# EAGLE design Esp8266_prot16_v3 (EAGLE 8.4.0)
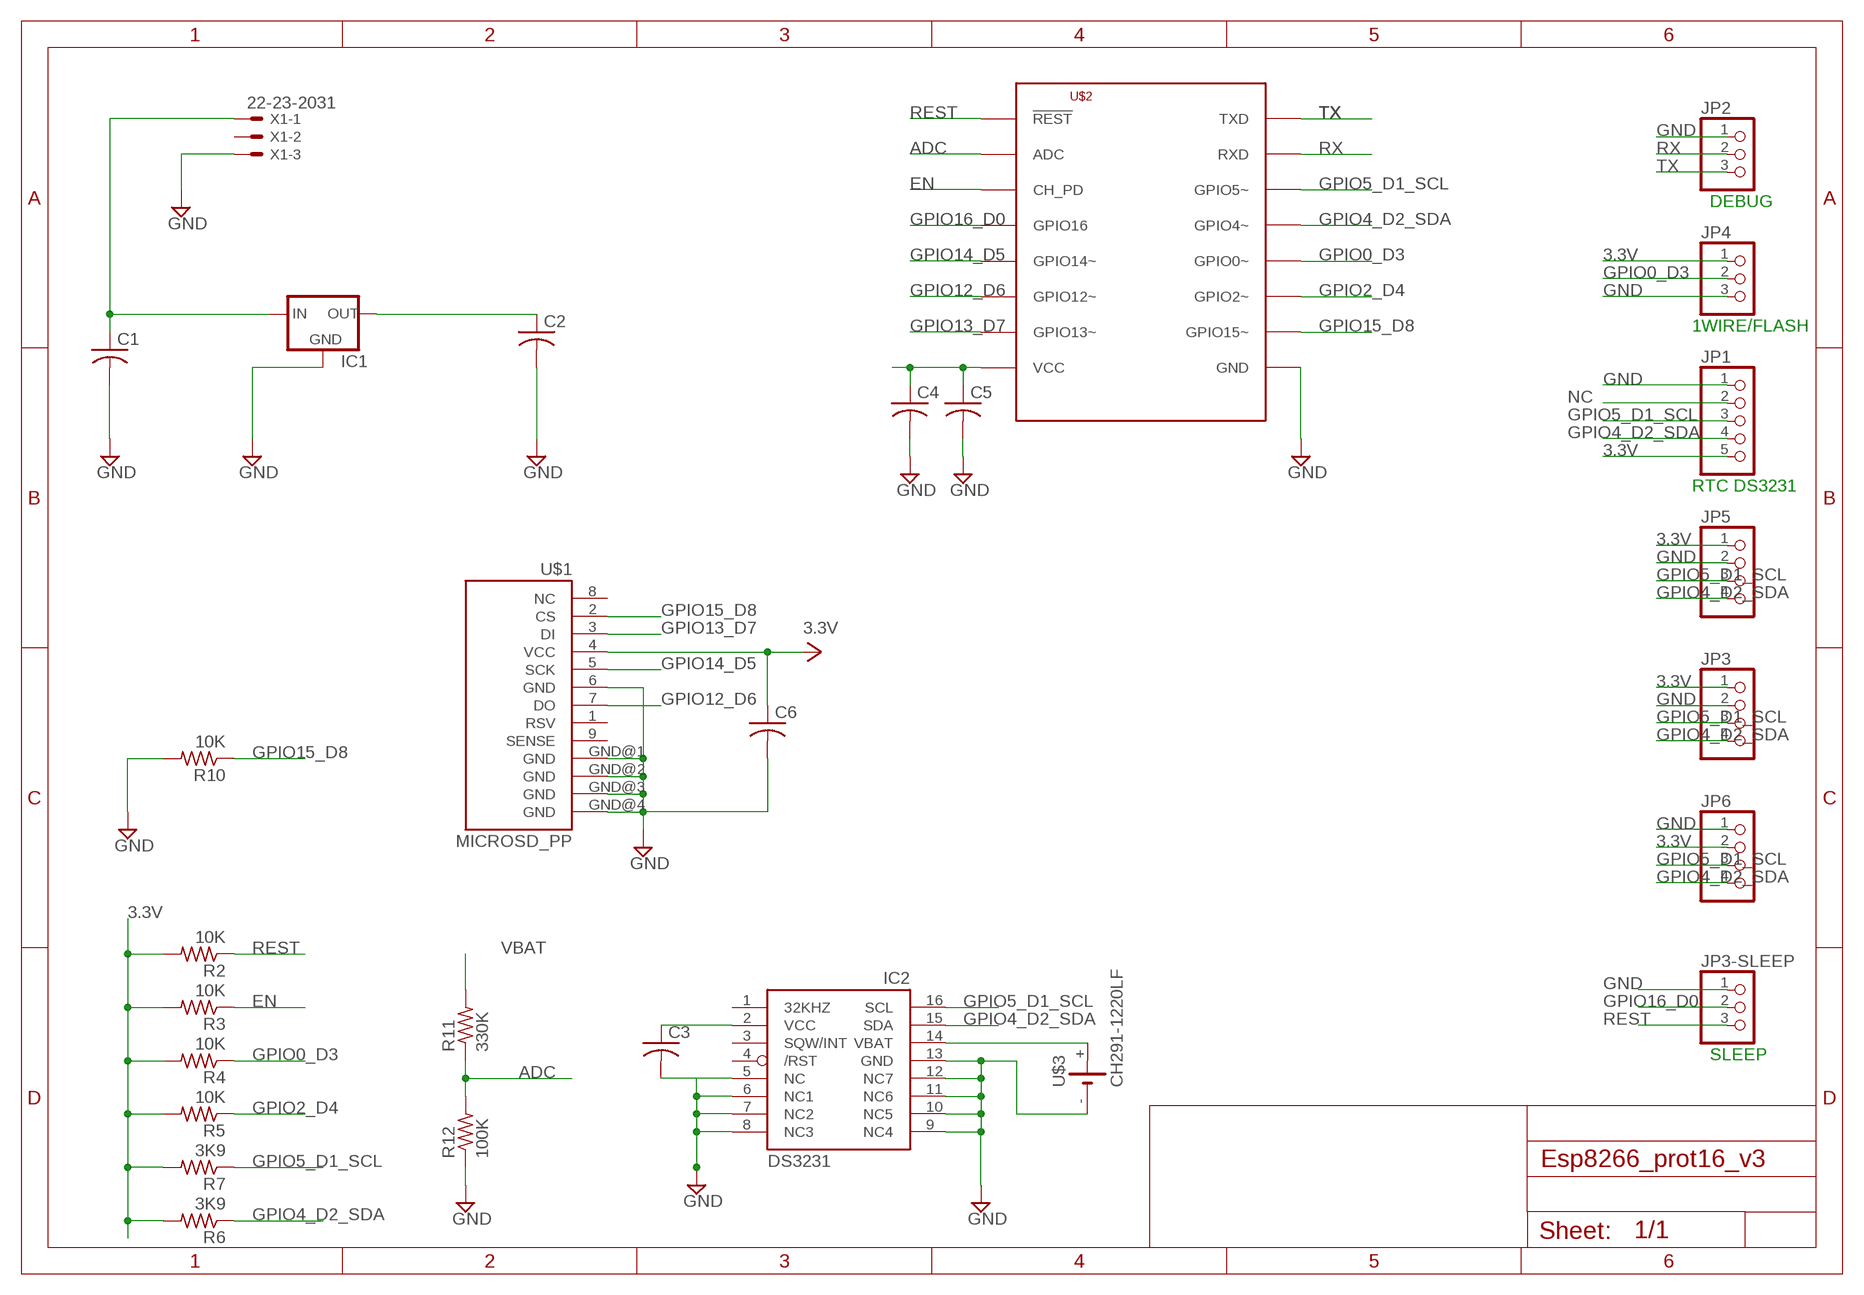
[diagram p0: schematic, sheet 1]

## Parts
C1  C-USC0805K  [C0805K]
C2  C-USC0805K  [C0805K]
C3  C-USC0805K  [C0805K]
C4  C-USC0805K  [C0805K]
C5  C-USC0805K  [C0805K]
C6  C-USC0805K  [C0805K]
IC1  XC63FPP  [SOT89R]
IC2  DS3231/SO  [SO16W]
JP1  PINHD-1X5/90  [1X05/90]
JP2  PINHD-1X3  [1X03]
JP3  PINHD-1X4/90  [1X04/90]
JP3-SLEEP  PINHD-1X3  [1X03]
JP4  PINHD-1X3  [1X03]
JP5  PINHD-1X4  [1X04]
JP6  PINHD-1X4  [1X04]
R2  10K  R-US_R0805  [R0805]
R3  10K  R-US_R0805  [R0805]
R4  10K  R-US_R0805  [R0805]
R5  10K  R-US_R0805  [R0805]
R6  3K9  R-US_R0805  [R0805]
R7  3K9  R-US_R0805  [R0805]
R10  10K  R-US_R0805  [R0805]
R11  330K  R-US_R0805  [R0805]
R12  100K  R-US_R0805  [R0805]
U$1  MICROSD_PP  [MICROSD_PP]
U$2  ESP8266-07  [ESP-07]
U$3  CH291-1220LF  [CH291-1220LF]
X1  22-23-2031  [22-23-2031]

## Nets
3.3V: C2.1 C3.1 C4.1 C5.1 C6.1 IC1.3(OUT) IC2.2(VCC) JP1.5 JP3.1 JP4.1 JP5.1 JP6.2 R2.2 R3.2 R4.2 R5.2 R6.2 R7.2 U$1.4(VCC) U$2.VCC
ADC: R11.1 R12.2 U$2.ADC
BATRTC: IC2.14(VBAT) U$3.+
EN: R3.1 U$2.CH_PD
GND: C1.2 C2.2 C3.2 C4.2 C5.2 C6.2 IC1.1(GND) IC2.5(NC) IC2.6(NC1) IC2.7(NC2) IC2.8(NC3) IC2.9(NC4) IC2.10(NC5) IC2.11(NC6) IC2.12(NC7) IC2.13(GND) JP1.1 JP2.1 JP3-SLEEP.1 JP3.2 JP4.3 JP5.2 JP6.1 R10.2 R12.1 U$1.6(GND) U$1.GND@1(GND) U$1.GND@2(GND) U$1.GND@3(GND) U$1.GND@4(GND) U$2.GND U$3.- X1.3
GPIO0_D3: JP4.2 R4.1 U$2.GPIO0(GPIO0~)
GPIO2_D4: R5.1 U$2.GPIO2(GPIO2~)
GPIO4_D2_SDA: IC2.15(SDA) JP1.4 JP3.4 JP5.4 JP6.4 R6.1 U$2.GPIO5(GPIO4~)
GPIO5_D1_SCL: IC2.16(SCL) JP1.3 JP3.3 JP5.3 JP6.3 R7.1 U$2.GPIO4(GPIO5~)
GPIO12_D6: U$1.7(DO) U$2.GPIO12(GPIO12~)
GPIO13_D7: U$1.3(DI) U$2.GPIO13(GPIO13~)
GPIO14_D5: U$1.5(SCK) U$2.GPIO14(GPIO14~)
GPIO15_D8: R10.1 U$1.2(CS) U$2.GPIO15(GPIO15~)
GPIO16_D0: JP3-SLEEP.2 U$2.GPIO16
NC: JP1.2
REST: JP3-SLEEP.3 R2.1 U$2.REST(!REST)
RX: JP2.2 U$2.RXD
TX: JP2.3 U$2.TXD
VBAT: C1.1 IC1.2(IN) R11.2 X1.1
Unconnected: IC2.1(32KHZ) IC2.3(SQW/INT) IC2.4(/RST) U$1.1(RSV) U$1.8(NC) U$1.9(SENSE) X1.2

## Notes on the sheet
- DEBUG
- 1WIRE/FLASH
- RTC DS3231
- SLEEP

## Library data of the parts
C1-C6 = adafruit:C-US: CAPACITOR, American symbol
IC1 = v-reg:XC63FP: Positiv Voltage Regulators www.torex.co.jp/english/product/pro02/pdf/0201_xc62fp.pdf
IC2 = adafruit:DS3231
JP1 = pinhead:PINHD-1X5: PIN HEADER
JP2 JP3-SLEEP JP4 = pinhead:PINHD-1X3: PIN HEADER
JP3 JP5 JP6 = pinhead:PINHD-1X4: PIN HEADER
R2-R7 R10-R12 = adafruit:R-US_: RESISTOR, American symbol
U$1 = DE1594-v2:MICROSD_PP
U$2 = lio:ESP8266
U$3 = battery:CH291-1220LF: Battery Holder, SMT, 12mm multicomp PART NO. CH291-1220LF Source: Data sheet <http://www.farnell.com/datasheets/1505860.pdf>
X1 = con-molex:22-23-2031: .100" (2.54mm) Center Header - 3 Pin; MF: MOLEX; MPN: 22-23-2031; OC_FARNELL: 1462950; OC_NEWARK: 30C0862

## Board
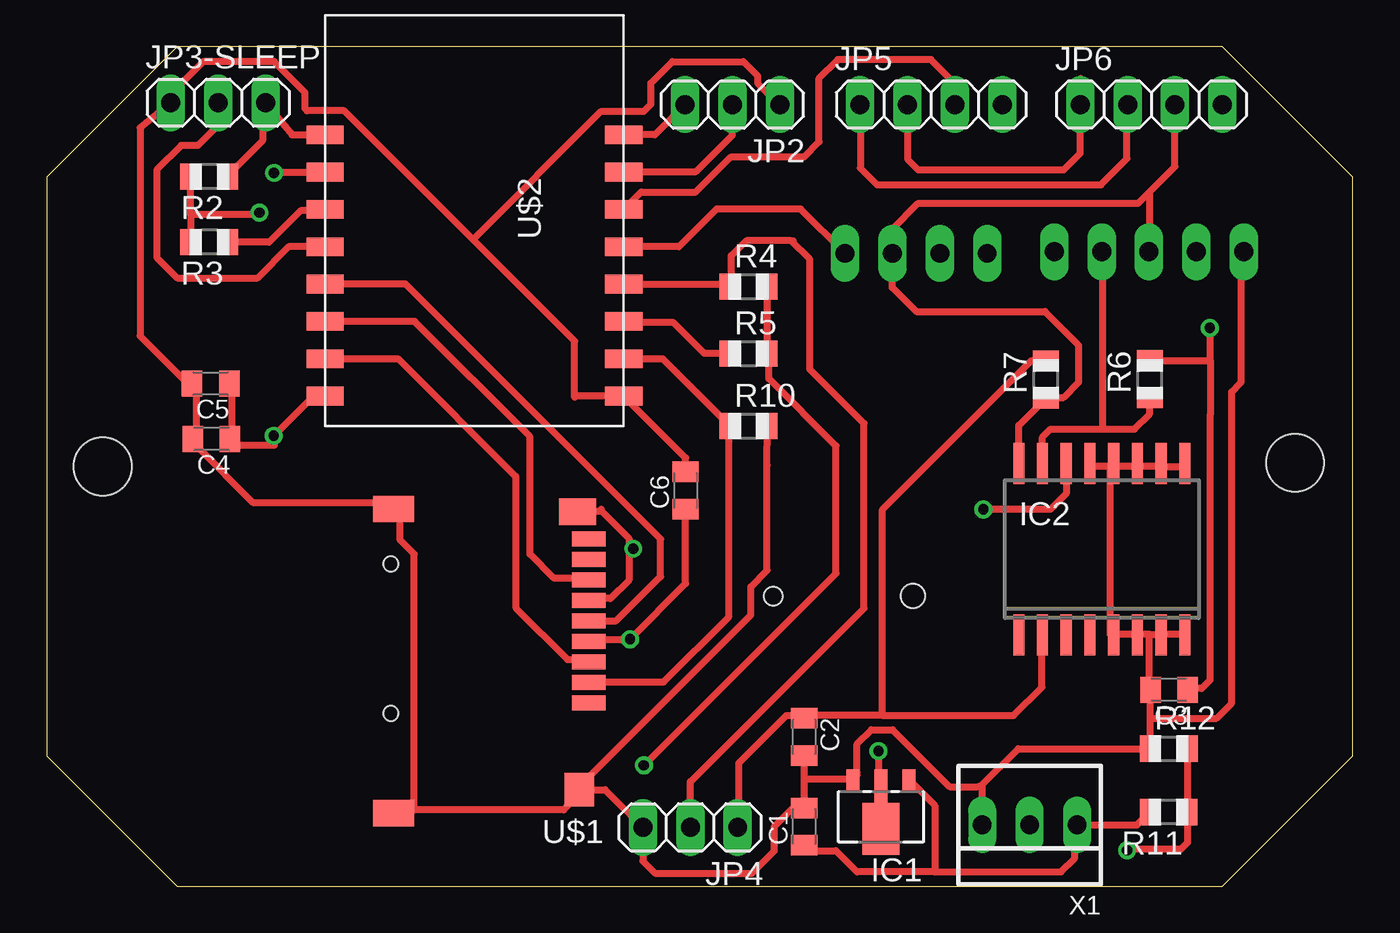
[diagram p1: board, top side]
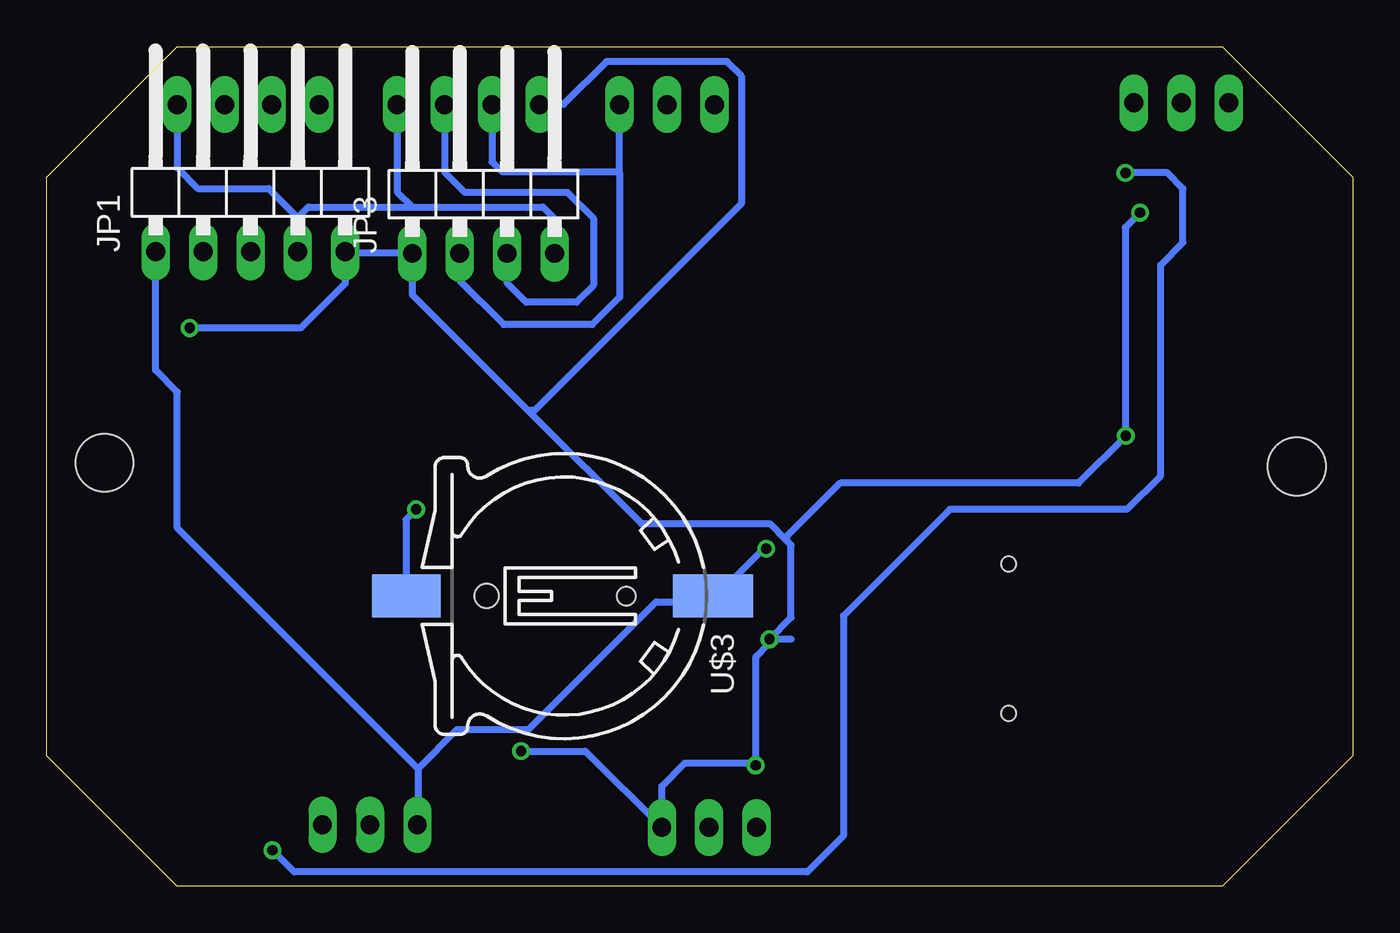
[diagram p2: board, bottom side, seen from below]

Size 70 x 45 mm. Coordinates in mm from the lower left corner, seen from the top.
Outline: 63,45 7,45 0,38 0,7 7,0 63,0 70,7 70,38 63,45
Copper layers (1*16): Top 0.035mm / dielectric 1.5mm / Bottom 0.035mm
Design rules "default *": minimum track width 15mil, minimum drill 0.55mm, track to track 15mil, track to pad 15mil, pad to pad 6mil, via to via 6mil, smd to smd 6mil, copper to edge 20mil, drill to drill 6mil, minimum pad ring 10mil, minimum via ring 8mil, stop-mask expansion 4mil, vias tented up to drill 0mil, thermal gap 10mil
Holes 3.1 mm at 3,22.5 66.9,22.7

### Footprints (pad centres in the part's own frame; a part is rotated, then mirrored left to right if it is on the bottom)
C0805K = smd 1.1 x 1.4: 1 -1,0; 2 1,0
SOT89R = smd 0.7 x 1.1: 1 1.5,-1.75; 2 -1.5,-1.75 | smd 0.7 x 1.8: 3 0,-1.4 | smd 2 x 2.8: 4 0,0.9
SO16W = smd 0.6 x 2.2: 1 -4.445,-4.6; 2 -3.175,-4.6; 3 -1.905,-4.6; 4 -0.635,-4.6; 5 0.635,-4.6; 6 1.905,-4.6; 7 3.175,-4.6; 8 4.445,-4.6; 9 4.445,4.6; 10 3.175,4.6; 11 1.905,4.6; 12 0.635,4.6; 13 -0.635,4.6; 14 -1.905,4.6; 15 -3.175,4.6; 16 -4.445,4.6
1X05/90 = drill 1.016 long: 1 -5.08,-3.81; 2 -2.54,-3.81; 3 0,-3.81; 4 2.54,-3.81; 5 5.08,-3.81
1X03 = drill 1.016 long: 1 -2.54,0; 2 0,0; 3 2.54,0
1X04/90 = drill 1.016 long: 1 -3.81,-3.81; 2 -1.27,-3.81; 3 1.27,-3.81; 4 3.81,-3.81
1X04 = drill 1.016 long: 1 -3.81,0; 2 -1.27,0; 3 1.27,0; 4 3.81,0
R0805 = smd 1.1 x 1.4: 1 -1,0; 2 1,0
MICROSD_PP = smd 1.8 x 0.8: 1 0,3.85; 2 0,2.75; 3 0,1.65; 4 0,0.55; 5 0,-0.55; 6 0,-1.65; 7 0,-2.75; 8 0,-3.85; 9 0,-4.95 | smd 1.6 x 1.8: GND@1 0.5,8.5 | smd 2.2 x 1.4: GND@2 10.45,9.75; GND@4 10.45,-6.55 | smd 2 x 1.4: GND@3 0.6,-6.4 | hole 0.8: 10.6,4.4; 10.6,-3.6
ESP-07 = smd 1 x 2: ADC -1.6,-8; CH_PD 0.4,-8; GND 10.4,8; GPIO0 4.4,8; GPIO2 6.4,8; GPIO4 0.4,8; GPIO5 2.4,8; GPIO12 6.4,-8; GPIO13 8.4,-8; GPIO14 4.4,-8; GPIO15 8.4,8; GPIO16 2.4,-8; REST -3.6,-8; RXD -1.6,8; TXD -3.6,8; VCC 10.4,-8
CH291-1220LF = smd 2.3 x 3.66: + 0,-2.296 | smd 2.3 x 4.3: - 0,14.146 | hole 1.3: 0,2 | hole 1: 0,9.5
22-23-2031 = drill 1 long: 1 -2.54,0; 2 0,0; 3 2.54,0

### Placement (x,y rotation side)
C1  40.6,3.2 90 top
C2  40.6,8 270 top
C3  60.15,10.53 180 top
C4  8.83,23.97 180 top
C5  8.79,26.94 180 top
C6  34.25,21.21 90 top
IC1  44.71,3.97 180 top
IC2  56.54,18.07 0 top
JP1  59.08,37.81 0 bottom
JP2  36.75,41.89 180 top
JP3  46.59,37.73 0 bottom
JP3-SLEEP  9.19,41.99 0 top
JP4  34.49,3.15 180 top
JP5  47.4,41.9 0 top
JP6  59.2,41.9 0 top
R2  8.72,38.04 180 top
R3  8.72,34.52 180 top
R4  37.62,32.14 0 top
R5  37.62,28.55 0 top
R6  59.12,27.18 90 top
R7  53.55,27.17 90 top
R10  37.62,24.67 0 top
R11  60.12,3.97 180 top
R12  60.14,7.37 0 top
U$1  29.05,13.67 180 top
U$2  22.93,36.68 270 top
U$3  48.43,15.55 270 bottom
X1  52.68,3.29 180 top

### Tracks (layer width: path | path; a pad name or v marks a point on that pad's centre or on a via)
3.3V  (via drill 0.55)
  Top 0.381: C5.1 9.91,26.67 9.91,24 C4.1 9.91,23.62 12.2,23.62 12.2,24.11 v12.16,24.14 14.3,26.28 U$2.VCC | 7.62,37.72 R2.2 7.72,36 | v31.26,13.23 29.23,13.23 U$1.4 | v44.58,7.24 44.58,5.71 IC1.3 | 31.51,13.23 v31.26,13.23 | IC2.2 53.34,13.34 53.34,10.67 51.82,9.14 44.8,9.14 | v32,6.48 42.3,16.77 42.3,23.6 38.7,27.2 38.7,28.47 R5.2 R4.2 | 40.74,9.14 arc90 C2.1 | 44.8,9.14 40.74,9.14 | JP4.1 37.1,3.21 37.1,6.6 39.64,9.14 40.74,9.14 | JP5.1 43.6,38.5 44.5,37.6 56.5,37.6 57.9,39 57.9,41.87 JP6.2 | 59.34,28.17 R6.2 62.33,28.18 62.35,28.2 | 62.35,28.2 62.35,25.25 62.34,25.26 62.34,11.04 61.9,10.6 61.22,10.6 C3.1 | 62.35,28.2 v62.35,29.91 v62.34,29.92 | 44.8,9.14 44.8,20.2 52.77,28.17 R7.2 | v31.26,13.23 34.25,16.22 C6.1 | 7.72,36 R3.2 | v11.4,36.1 11.3,36 7.72,36
  Bottom 0.381: v31.26,13.23 31.32,13.23 31.32,12.98 32,12.3 32,6.6 | v32,6.48 32,6.6 | 30.1,13.23 v31.26,13.23 | v44.58,7.24 41.13,7.24 JP4.1 37.03,5.37 35.8,6.6 32,6.6 | 30.36,18.54 30.1,18.29 30.1,14.39 v31.26,13.23 | 30.36,18.54 31.24,19.43 38.13,19.43 44.2,25.5 | 50.29,33.91 JP3.1 | JP5.1 43.43,41.91 42.29,41.91 40.01,44.2 33.53,44.2 32.77,43.43 32.77,36.58 43.84,25.5 44.2,25.5 | JP3.1 53.92,33.92 JP1.5 54,32.3 56.38,29.92 v62.34,29.92 | JP3.1 50.4,31.7 44.2,25.5 | 30.36,18.54 30.36,18.74 27.5,21.6 14.71,21.6 v12.16,24.14 12.2,24.18 12.2,35.3 v11.4,36.1
ADC  (via drill 0.55)
  Top 0.381: R12.2 61.14,3.99 R11.1 61.15,3.47 61.15,2.35 60.8,2 57.97,2 v57.9,1.92 | v12.18,38.23 14.88,38.23 U$2.ADC
  Bottom 0.381: v57.9,1.92 56.74,0.76 29.24,0.76 27.3,2.7 27.3,14.5 21.6,20.2 12.1,20.2 10.3,22 10.3,33.3 9.1,34.5 9.1,37.4 9.93,38.23 v12.18,38.23
BATRTC  (via drill 0.55)
  Top 0.381: 54.5,22.5 IC2.14 54.64,21.04 53.8,20.2 v50.2,20.2
  Bottom 0.381: 50.75,15.59 51,16 | 50.75,15.59 U$3.+ | v50.2,20.2 50.75,19.65 50.75,15.59
EN
  Top 0.381: U$2.CH_PD 14.85,36.2 13.6,36.2 11.92,34.52 R3.1
GND  (via drill 0.55)
  Top 0.381: 28.08,20.09 U$1.GND@3 28.46,20.09 29.7,20.09 29.72,20.19 29.7,20.15 31.2,18.65 31.2,18.15 v31.44,18.09 31.2,17.9 31.2,16.4 30.2,15.4 30.18,15.45 29.18,15.45 U$1.6 | 28.85,5.23 U$1.GND@1 | 19.7,4.09 27.7,4.09 28.46,4.85 U$1.GND@1 | 19.7,4.09 18.94,4.09 U$1.GND@2 | 19.7,4.09 19.7,17.81 18.94,18.57 18.94,20.09 U$1.GND@4 18.56,20.47 18.46,20.57 11.05,20.57 8,23.62 C4.2 8,24 8,26.67 C5.2 7.62,27.05 7.45,27.05 5,29.5 5,40.65 JP3-SLEEP.1 6.48,42.29 8.38,44.2 12.19,44.2 13.85,42.54 13.85,41.68 13.96,41.57 15.95,41.57 22.85,34.66 | 57,22.5 56,22.5 IC2.13 | 58.5,22.5 59.5,22.5 IC2.10 60,22.5 61,22.5 IC2.9 | 58.5,22.5 57,22.5 | 58.5,22.5 IC2.11 | 58.5,13.5 57,13.5 | IC2.8 61,13.5 60,13.5 IC2.7 59.5,13.5 59.1,13.5 | 59.1,13.5 58.5,13.5 | 58.5,13.5 IC2.6 | 57,13.5 57,22.5 | 57,22.5 IC2.12 | 57,13.5 IC2.5 | JP1.1 64,34 64,27 63.5,26.5 63.5,9.8 62.7,9 59.14,9 | R10.2 38.61,22.56 38.61,16.93 37.73,16.05 37.73,14.53 28.55,5.35 U$1.GND@1 | 40.6,5.7 C2.2 | C1.2 40.6,5.7 | 43.43,5.94 IC1.1 | IC1.1 40.62,5.72 40.6,5.7 | U$1.GND@1 29.93,5.17 JP4.3 31.95,1.34 32.6,0.7 37.8,0.7 39,1.9 39,3.2 40,4.2 C1.2 | 40.1,4.2 C1.2 | X1.3 50.14,5.36 50.1,5.4 | 50.1,5.4 49.91,5.33 48.39,5.33 45.34,8.38 44.2,8.38 43.43,7.62 43.43,6.1 IC1.1 | JP5.2 46.13,38.97 46.7,38.4 54.5,38.4 55.39,39.29 JP6.1 55.4,43.3 | 50.1,5.4 52.07,7.37 R12.1 59.14,9 | 59.14,9 59.14,10.52 C3.2 59.1,10.58 59.1,13.5 | C6.2 34.25,22.96 U$2.GND 28.38,26.28 28.3,26.2 28.3,29.21 22.85,34.66 | 22.85,34.66 29.72,41.53 32,41.53 32.38,41.91 32.38,43.05 33.53,44.2 37.34,44.2 38.1,43.43 38.1,43.05 39.24,41.91 JP2.1
  Bottom 0.381: 34.06,15.59 33.91,15.62 | 34.06,15.59 U$3.- 34.29,15.24 37.34,15.24 44.2,8.38 48.02,8.38 50.1,6.3 | v31.44,18.09 31.47,18.19 34.06,15.59 | 50.1,6.3 50.1,3.32 X1.3 | 46.1,41.53 JP5.2 46.13,38.83 45.6,38.3 39.39,38.3 39.29,38.2 | JP3.2 47.86,32.46 45.5,30.1 40.77,30.1 39.29,31.57 39.29,38.2 | 39.29,38.2 JP2.1 | 50.1,6.3 63,19.2 63,26.5 64.16,27.66 JP1.1
GPIO0_D3
  Top 0.381: JP4.2 34.5,5.6 43.8,14.9 43.8,24.8 40.9,27.7 40.9,33.6 39.9,34.6 | U$2.GPIO0 36.48,32.28 R4.1 36.7,32.22 36.7,33.8 37.5,34.6 39.9,34.6 | 39.9,34.6 40,34.6
GPIO2_D4
  Top 0.381: R5.1 35.25,28.55 33.6,30.2 31,30.2 U$2.GPIO2
GPIO4_D2_SDA
  Top 0.381: 53.34,23.62 53.34,22.86 IC2.15 53.37,24.07 53.8,24.5 56.6,24.5 | R6.1 59.12,25.32 58.3,24.5 56.6,24.5 | 56.6,24.5 56.6,33.94 JP1.4 | 42.76,33.9 JP3.4 40.4,36.3 35.9,36.3 33.88,34.28 U$2.GPIO5
  Bottom 0.381: JP6.4 63.01,38.51 61.9,37.4 58.1,37.4 56.54,35.84 | 56.54,35.84 JP1.4 | 50.4,36.4 43.4,36.4 42.78,35.78 JP3.4 | JP5.4 51.21,37.21 50.4,36.4 | 56.54,35.84 55.98,36.4 50.4,36.4
GPIO5_D1_SCL
  Top 0.381: 52,23 IC2.16 52.1,24.7 53.55,26.14 R7.1 53.58,26.2 54.5,26.2 55.3,27 55.3,29 53.5,30.8 46.6,30.8 45.32,32.08 JP3.3 45.32,35.22 46.7,36.6 58.5,36.6 59.1,37.2 | JP6.3 60.47,38.57 59.1,37.2 | 59.1,37.2 59.1,34.02 JP1.3 | JP5.3 48.7,41.93 48.7,43 47.4,44.3 42.4,44.3 41.4,43.3 41.4,39.9 40.6,39.1 36.68,39.1 34.78,37.2 31.86,37.2 U$2.GPIO4
  Bottom 0.381: JP3.3 45.32,32.32 44.3,31.3 41.6,31.3 40.7,32.2 40.7,35.8 42.1,37.2 47.6,37.2 48.67,38.27 JP5.3
GPIO12_D6
  Top 0.381: U$1.7 28.97,16.5 27.2,16.5 25.9,17.8 25.9,24.1 19.72,30.28 U$2.GPIO12
GPIO13_D7
  Top 0.381: U$1.3 28.85,12.09 28.79,12.15 27.91,12.15 25.14,14.92 25.14,21.96 18.82,28.28 U$2.GPIO13
GPIO14_D5
  Top 0.381: U$1.5 30.52,14.22 32.9,16.6 32.9,18.6 19.22,32.28 U$2.GPIO14
GPIO15_D8
  Top 0.381: U$1.2 29.23,10.95 33.07,10.95 36.56,14.44 36.56,24.61 R10.1 33.01,28.28 U$2.GPIO15
GPIO16_D0
  Top 0.381: JP3-SLEEP.2 9,41.88 9,40.6 8.1,39.7 7.2,39.7 5.9,38.4 5.9,33.7 7,32.6 11.3,32.6 13,34.3 14.9,34.3 U$2.GPIO16
REST
  Top 0.381: R2.1 9.91,38.1 9.91,38.31 11.6,40 11.6,41.87 JP3-SLEEP.3 13.14,40.28 U$2.REST
RX
  Top 0.381: U$2.RXD 30.95,38.3 34.8,38.3 36.75,40.25 JP2.2
TX
  Top 0.381: 34.29,41.82 JP2.3 32.59,40.28 U$2.TXD
VBAT
  Top 0.381: C1.1 arc90 40.9,1.91 42.29,1.91 43.43,0.76 47.6,0.76 | 47.6,0.76 54.36,0.76 55.1,1.5 55.1,3.17 X1.1 58.44,3.29 R11.2 | IC1.2 47.6,4.33 47.6,0.76